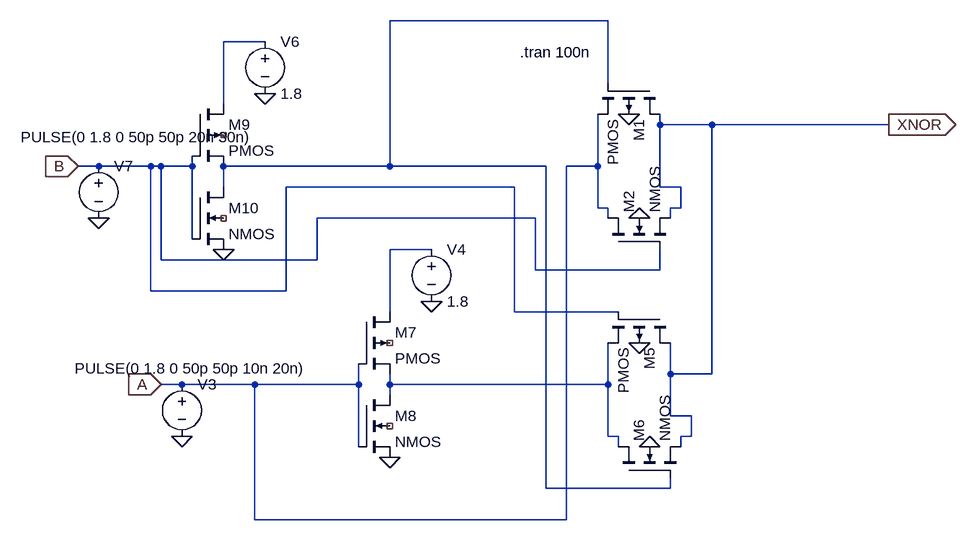
[diagram p0: schematic XNOR.asc]
XNOR.asc, the LTspice schematic file:
Version 4.1
SHEET 1 1028 772
WIRE 208 0 -128 0
WIRE -320 32 -384 32
WIRE 208 96 208 0
WIRE -384 128 -384 32
WIRE 288 160 288 144
WIRE 368 160 288 160
WIRE 640 160 368 160
WIRE -576 224 -608 224
WIRE -496 224 -576 224
WIRE -480 224 -496 224
WIRE -432 224 -432 208
WIRE -432 224 -480 224
WIRE -128 224 -128 0
WIRE -128 224 -384 224
WIRE 112 224 -128 224
WIRE 192 224 192 144
WIRE 192 224 144 224
WIRE -384 256 -384 224
WIRE 64 256 -288 256
WIRE 288 256 288 160
WIRE 320 256 288 256
WIRE 192 288 192 224
WIRE 208 288 192 288
WIRE 320 288 320 256
WIRE 320 288 304 288
WIRE 96 304 -240 304
WIRE 208 304 208 288
WIRE 304 304 304 288
WIRE -432 336 -432 224
WIRE -64 352 -128 352
WIRE -480 368 -480 224
WIRE -240 368 -240 304
WIRE -240 368 -480 368
WIRE 96 384 96 304
WIRE 288 384 288 352
WIRE 288 384 96 384
WIRE -496 416 -496 224
WIRE -288 416 -288 256
WIRE -288 416 -496 416
WIRE -128 448 -128 352
WIRE 64 448 64 256
WIRE 224 448 64 448
WIRE 304 544 304 496
WIRE 368 544 368 160
WIRE 368 544 304 544
WIRE -448 560 -480 560
WIRE -336 560 -448 560
WIRE -176 560 -176 528
WIRE -176 560 -336 560
WIRE -128 560 -128 544
WIRE 208 560 208 496
WIRE 208 560 -128 560
WIRE -128 576 -128 560
WIRE 304 608 304 544
WIRE 336 608 304 608
WIRE 208 640 208 560
WIRE 224 640 208 640
WIRE 336 640 336 608
WIRE 336 640 320 640
WIRE -176 656 -176 560
WIRE 224 656 224 640
WIRE 320 656 320 640
WIRE 112 720 112 224
WIRE 304 720 304 704
WIRE 304 720 112 720
WIRE -336 768 -336 560
WIRE 144 768 144 224
WIRE 144 768 -336 768
FLAG -480 560 A
IOPIN -480 560 In
FLAG -448 640 0
FLAG 640 160 XNOR
IOPIN 640 160 Out
FLAG 240 144 0
FLAG 256 304 0
FLAG 256 496 0
FLAG 272 656 0
FLAG -128 672 0
FLAG -64 432 0
FLAG -384 352 0
FLAG -320 112 0
FLAG -576 304 0
FLAG -608 224 B
IOPIN -608 224 In
SYMBOL pmos4 288 96 R90
SYMATTR InstName M1
SYMBOL nmos4 208 352 R270
SYMATTR InstName M2
SYMBOL voltage -448 544 R0
WINDOW 3 -165 -9 Left 2
WINDOW 123 0 0 Left 0
WINDOW 39 0 0 Left 0
SYMATTR Value PULSE(0 1.8 0 50p 50p 10n 20n)
SYMATTR InstName V3
SYMBOL pmos4 304 448 R90
SYMATTR InstName M5
SYMBOL nmos4 224 704 R270
SYMATTR InstName M6
SYMBOL pmos4 -176 448 R0
SYMATTR InstName M7
SYMBOL nmos4 -176 576 R0
SYMATTR InstName M8
SYMBOL voltage -64 336 R0
WINDOW 123 0 0 Left 0
WINDOW 39 0 0 Left 0
SYMATTR InstName V4
SYMATTR Value 1.8
SYMBOL pmos4 -432 128 R0
SYMATTR InstName M9
SYMBOL nmos4 -432 256 R0
SYMATTR InstName M10
SYMBOL voltage -320 16 R0
WINDOW 123 0 0 Left 0
WINDOW 39 0 0 Left 0
SYMATTR InstName V6
SYMATTR Value 1.8
SYMBOL voltage -576 208 R0
WINDOW 3 -120 -29 Left 2
WINDOW 123 0 0 Left 0
WINDOW 39 0 0 Left 0
SYMATTR Value PULSE(0 1.8 0 50p 50p 20n 30n)
SYMATTR InstName V7
TEXT 72 48 Left 2 !.tran 100n

The netlist it stands for:
* XNOR.asc
M1 XNOR N001 A 0 PMOS
M2 A B XNOR 0 NMOS
V3 A 0 PULSE(0 1.8 0 50p 50p 10n 20n)
M5 XNOR B N004 0 PMOS
M6 N004 N001 XNOR 0 NMOS
M7 N003 A N004 NC_01 PMOS
M8 N004 A 0 NC_02 NMOS
V4 N003 0 1.8
M9 N002 B N001 NC_03 PMOS
M10 N001 B 0 NC_04 NMOS
V6 N002 0 1.8
V7 B 0 PULSE(0 1.8 0 50p 50p 20n 30n)
.model NMOS NMOS
.model PMOS PMOS
.lib standard.mos
.tran 100n
.backanno
.end